# EAGLE design board (EAGLE 7.6.0)
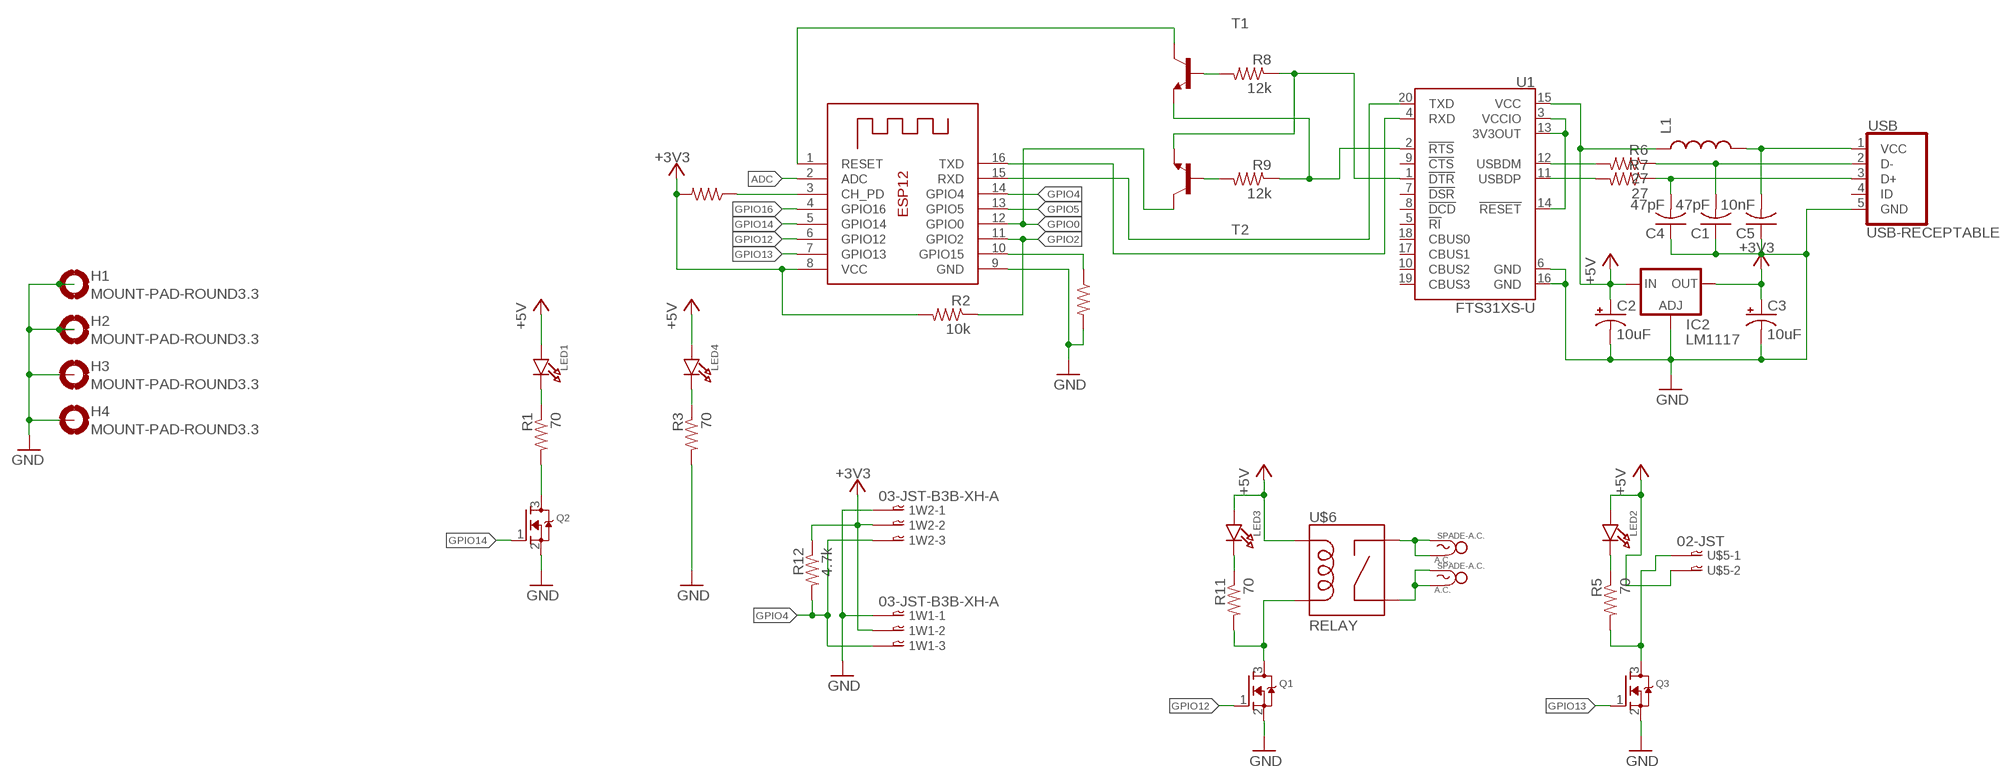
[diagram p0: schematic, sheet 1]

## Parts
1W1  03-JST-B3B-XH-A  [B3B-XH]
1W2  03-JST-B3B-XH-A  [B3B-XH]
C1  47pF  C-USC0603  [C0603]
C2  10uF  CPOL-US153CLV-0405  [153CLV-0405]
C3  10uF  CPOL-US153CLV-0405  [153CLV-0405]
C4  47pF  C-USC0603  [C0603]
C5  10nF  C-USC0603  [C0603]
H1  MOUNT-PAD-ROUND3.3  [3,3-PAD]
H2  MOUNT-PAD-ROUND3.3  [3,3-PAD]
H3  MOUNT-PAD-ROUND3.3  [3,3-PAD]
H4  MOUNT-PAD-ROUND3.3  [3,3-PAD]
IC2  LM1117  LD117ADT-TR  [DPACK]
L1  INDUCTOR0805  [0805]
LED1  LED0805  [CHIPLED_0805]
LED2  LED0805  [CHIPLED_0805]
LED3  LED0805  [CHIPLED_0805]
LED4  LED0805  [CHIPLED_0805]
Q1  MOSFET-NREFLOW  [SOT23]
Q2  MOSFET-NREFLOW  [SOT23]
Q3  MOSFET-NREFLOW  [SOT23]
R1  70  R-US_R0603  [R0603]
R2  10k  R-US_R0603  [R0603]
R3  70  R-US_R0603  [R0603]
R4  10k  R-US_R0603  [R0603]
R5  70  R-US_R0603  [R0603]
R6  27  R-US_R0603  [R0603]
R7  27  R-US_R0603  [R0603]
R8  12k  R-US_R0603  [R0603]
R9  12k  R-US_R0603  [R0603]
R10  10k  R-US_R0603  [R0603]
R11  70  R-US_R0603  [R0603]
R12  4.7k  R-US_R0603  [R0603]
T1  MMBT918LT1-NPN-SOT23-BEC  [SOT23-BEC]
T2  MMBT918LT1-NPN-SOT23-BEC  [SOT23-BEC]
U1  FTS31XS-U  FT231XS  [SSOP20_L]
U$1  SPADE-A.C.  [SPADE-A.C.]
U$2  SPADE-A.C.  [SPADE-A.C.]
U$5  02-JST  [B2B-XH]
U$6  RELAY  [RELAY-G5NB]
USB  USB-RECEPTABLE  [FCI-10103594-0001LF]
X1  ESP-12  [ESP-12]

## Nets
+3V3: 1W1.P$2 1W2.P$2 C3.+ IC2.4(OUT) R2.2 R4.2 R12.1 X1.8(VCC)
+5V: C2.+ IC2.3(IN) L1.1 LED1.A LED2.A LED3.A LED4.A U1.15(VCC) U$5.P$2 U$6.1(COIL1)
ADC: X1.2(ADC)
GND: 1W1.P$1 1W2.P$1 C1.1 C2.- C3.- C4.1 C5.1 H1.B3,3(MOUNT) H2.B3,3(MOUNT) H3.B3,3(MOUNT) H4.B3,3(MOUNT) IC2.1(ADJ) Q1.2(S) Q2.2(S) Q3.2(S) R3.2 R10.2 U1.6(GND) U1.16(GND) USB.5(GND) X1.9(GND)
GND1: Q3.3(D) R5.2 U$5.P$1
GND2: Q1.3(D) R11.2 U$6.4(COIL2)
GND3: Q2.3(D) R1.2
GPIO0: T2.C X1.12(GPIO0)
GPIO2: R2.1 X1.11(GPIO2)
GPIO4: 1W1.P$3 1W2.P$3 R12.2 X1.14(GPIO4)
GPIO5: X1.13(GPIO5)
GPIO12: Q1.1(G) X1.6(GPIO12)
GPIO13: Q3.1(G) X1.7(GPIO13)
GPIO14: Q2.1(G) X1.5(GPIO14)
GPIO15: R10.1 X1.10(GPIO15)
GPIO16: X1.4(GPIO16)
N$1: R4.1 X1.3(CH_PD)
N$2: C4.2 R7.1 USB.3(D+)
N$3: R7.2 U1.11(USBDP)
N$4: LED4.C R3.1
N$5 [ac]: U$2.P$1 U$2.P$2 U$6.3(NO)
N$6 [ac]: U$1.P$1 U$1.P$2 U$6.2(MAIN)
N$7: C5.2 L1.2 USB.1(VCC)
N$8: LED3.C R11.1
N$9: R6.2 U1.12(USBDM)
N$10: LED2.C R5.1
N$12: LED1.C R1.1
N$13: C1.2 R6.1 USB.2(D-)
N$14: R8.1 T2.E U1.1(!DTR)
N$15: R9.1 T1.E U1.2(!RTS)
N$16: R8.2 T1.B
N$17: R9.2 T2.B
N$19: U1.3(VCCIO) U1.13(3V3OUT) U1.14(!RESET)
RST: T1.C X1.1(RESET)
RXI: U1.20(TXD) X1.15(RXD)
TXO: U1.4(RXD) X1.16(TXD)
Unconnected: U1.5(!RI) U1.7(!DSR) U1.8(!DCD) U1.9(!CTS) U1.10(CBUS2) U1.17(CBUS1) U1.18(CBUS0) U1.19(CBUS3) USB.4(ID)

## Library data of the parts
1W1 1W2 = con-jst-xh:03-JST: JST CONNECTOR
C1 C4 C5 = rcl:C-US: CAPACITOR, American symbol
C2 C3 = rcl:CPOL-US: POLARIZED CAPACITOR, American symbol
H1-H4 = holes:MOUNT-PAD-ROUND: MOUNTING PAD, round
IC2 = v-reg:LD117A?*: Low drop fixed and adjustable positive voltage regulators 1 A Source: http://www.st.com/stonline/products/literature/ds/7194/ld1117axx.pdf
L1 = SparkFun-Passives:INDUCTOR: Inductors Basic Inductor/Choke - 0603 and 1206. Footprints are not proven and vary greatly between part numbers. INDUCTOR POWER 3.3UH 4.0A SMD 0.197" L x 0.197" W x 0.177" H (5.00mm x 5.00mm x 4.50mm)
LED1-LED4 = microbuilder:LED: LED 0603 - 0603 Surface Mount Package 2mA: Green LED - Low Power (3.9mcd, 2ma, 1.7Vf) - Digikey: 475-2709-2-ND Orange LED - Low Power (9.8mcd, 2ma, 1.8Vf) - Digikey: 475-1194-2-ND Red LED - Low Power (5mcd, 2ma, 1.8Vf) - Digikey: 475-1195-2-ND Yellow LED - Low Power (7mcd, 2ma, 1.8Vf) - Digikey: 475-1196-2-ND 5mA: Blue LED - Low Power (17mcd, 5ma, 2.9Vf) - Digikey: LNJ937W8CRACT-ND 0805 - 0805 Surface Mount Package 2mA: Red LED (8.8mcd, 2mA, 1.8Vf, Clear) - Low Power [Digikey: 475-2510-1-ND] Green LED (5mcd, 2mA, 1.8Vf, Clear) - Low Power [Digikey: 475-2730-1-ND] Yellow LED (11.3mcd, 2mA, 1.8Vf, Clear) - Low Power [Digikey: 475-2555-1-ND] 20mA: Red LED (104mcd, 20mA, Diffused) - LS R976 [Digikey: 475-1278-6-ND] Red LED (12mcd, 20mA, 2.0Vf, Clear) - APT2012EC [Digikey: 754-1128-1-ND] Green LED (15mcd, 20mA, 2.2Vf, Clear) - APT2012GC [Digikey: 754-1131-1-ND] Orange LED (160mcd, 20mA, 2.1Vf, Clear) - APT2012SECK [Digikey: 754-1130-1-ND] 1206 - 1206 Surface Mount Package Green LED (26mcd, 20mA, Diffused) - LG N971 [Digikey: 475-1407-6-ND] Red LED (15mcd, 20mA, Diffused) - LH N974 [Digikey: 475-1416-6-ND] Cree - Cree High-Power Surface Mount LEDs XPEBWT-L1-0000-00D50 - White 111lm 350mA 2.9Vf 6200K 110° XTEAWT-00-0000-00000LEE3 - White 114lm 350mA 2.85Vf 5000K 115° Everlight - Everlight 45-21 Series Surface Mount LEDs 45-21/QK2C-B2832AC2CB2/2T - Warm White 2000mcd 20mA 3.25Vf 3050K 120° 45-21/LK2C-B38452C4CB2/2T - Nuetral White 2000mcd 20mA 3.25Vf 4150K 120° 45-21/LK2C-B50634C6CB2/2T - Cold White 2200mcd 20mA 3.25Vf 5650K 120° PLCC2 Reverse Mount LS T77K-J1L2-1-0-2-R18-Z - Red 11.25mcd 2mA 1.8Vf 630nm 120° LO T77K-L1M2-24-Z - Orange 19.6mcd 2mA 1.8Vf 606nm 120° LY T77K-K2M1-26-Z - Yellow 15.7mcd 2mA 1.8Vf 587nm 120°
Q1-Q3 = adafruit:MOSFET-N: N-Channel Mosfet 2N7002E - 60V 260mA SOT23 [Digikey: 2N7002ET1GOSTR-ND] - REEL BSH103 - 30V 850mA SOT23 [Digikey: 568-5013-1-ND]
R1-R12 = resistor:R-US_: RESISTOR, American symbol
T1 T2 = transistor:*-NPN-: NPN Transistror BF959 corrected 2008.03.06
U1 = SparkFun-DigitalIC:FT231X: FTDI FT231X Full Speed USB to Full-handshake UART This USB2.0 Full Speed IC offers a compact bridge to full handshake UART interfaces. The device is a UART, capable of operating up to 3MBaud, with low power consumption (8mA). The FT231X includes the complete FT-X series feature set and enables USB to be added into a system design quickly and easily over a UART interface.; PROD_ID: IC-11524
U$1 U$2 = Spade-terminals:SPADE-A.C.: 0.25" Spade
U$5 = con-jst-xh:02-JST: JST CONNECTOR
U$6 = kleinpa:RELAY: SPDT relay (COM-00101)
USB = daspilker:USB-RECEPTABLE: USB Receptable
X1 = adafruit:ESP-12

## Net classes
0 default: drill 0.305 mm
1 ac: width 1.93 mm, clearance 5 mm
2 5v: width 0.61 mm

## Board
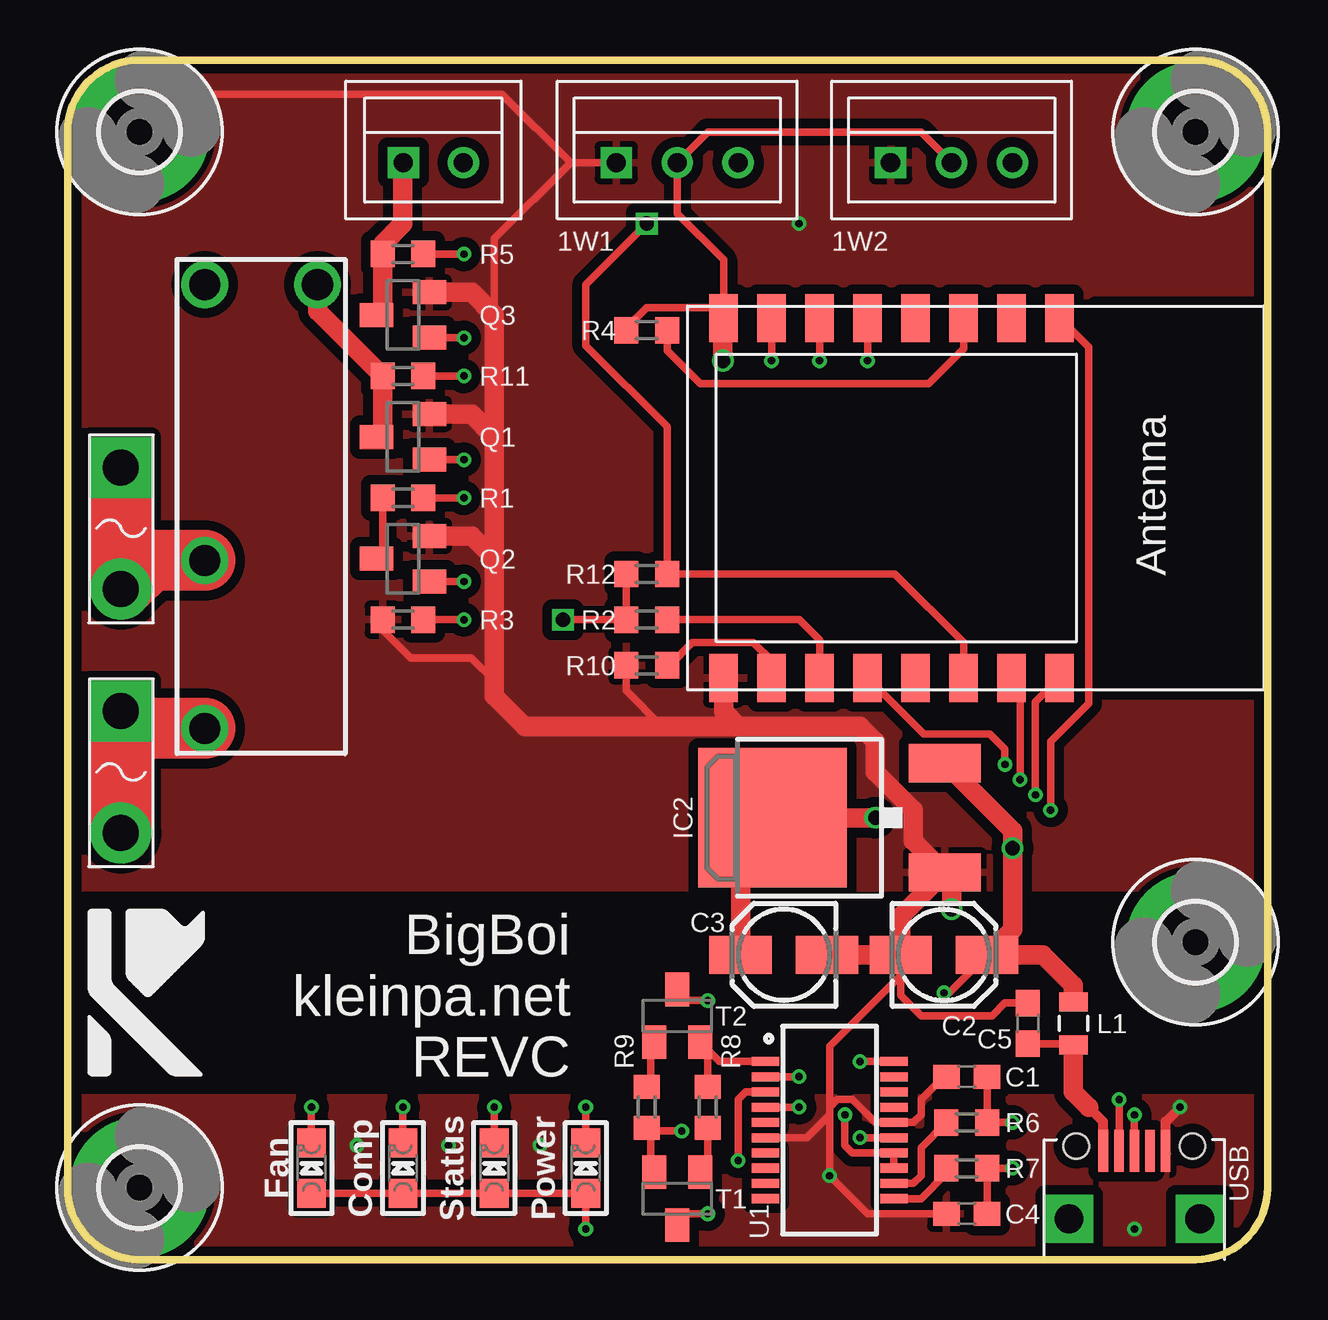
[diagram p1: board, top side]
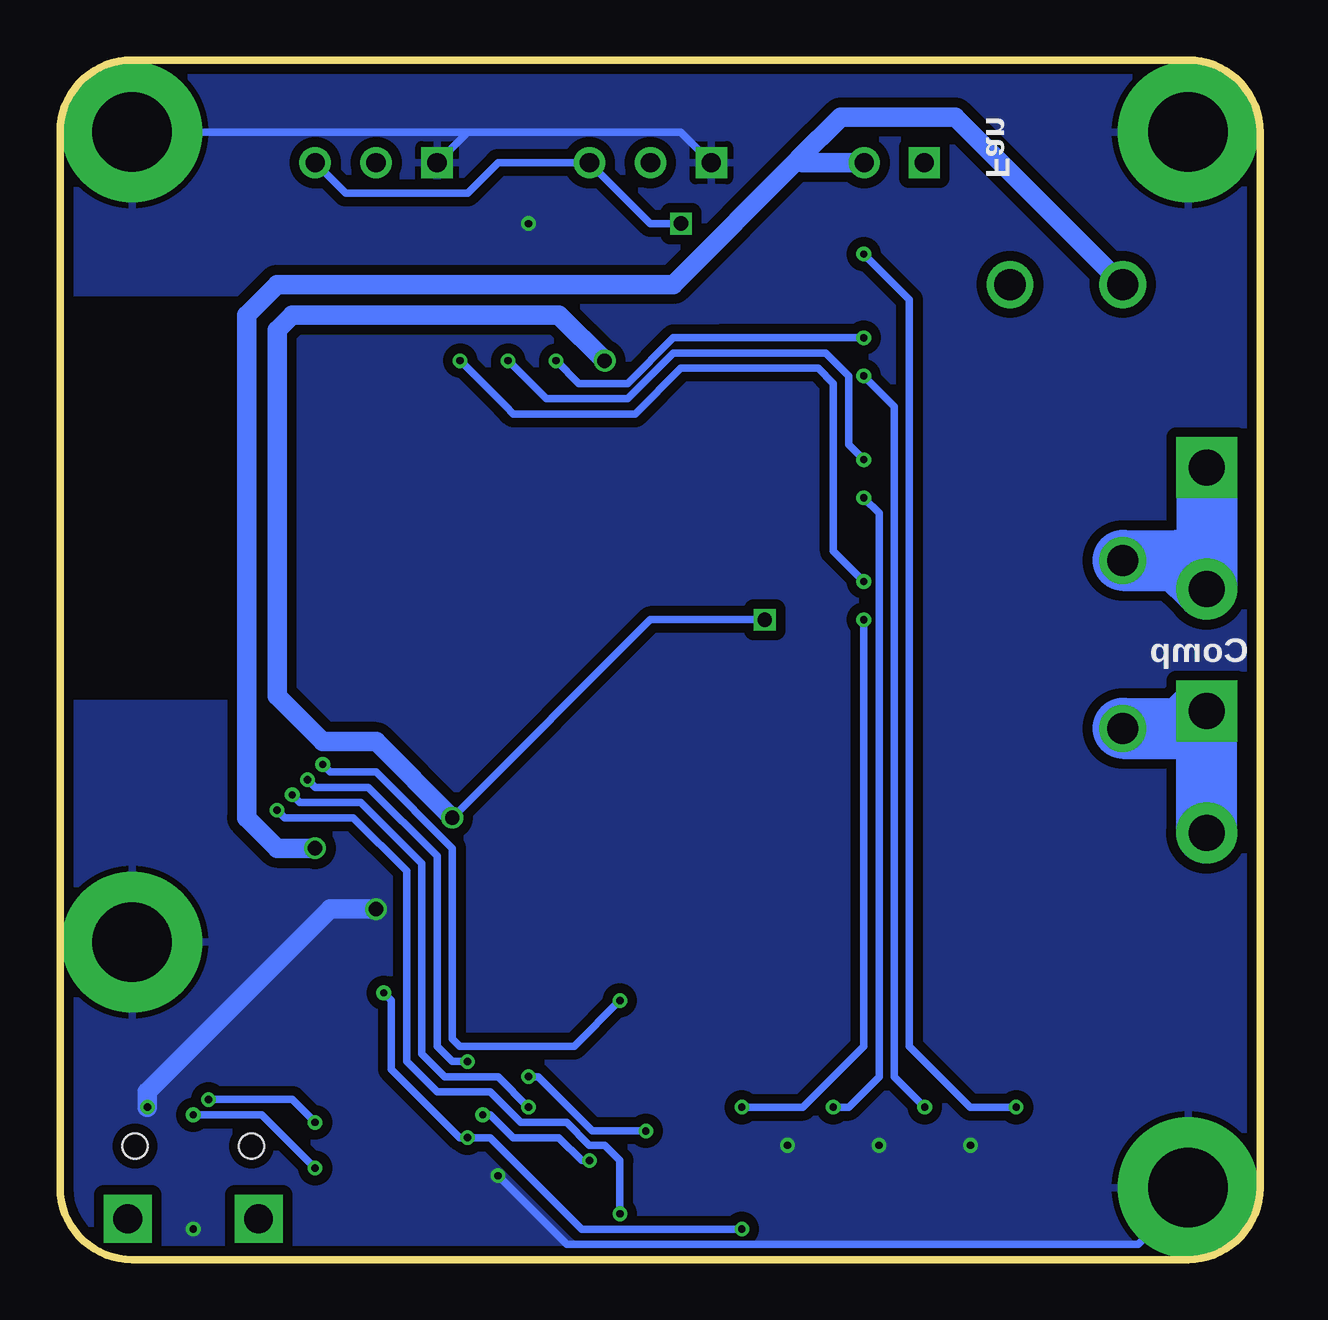
[diagram p2: board, bottom side, seen from below]

Size 50 x 50 mm. Coordinates in mm from the lower left corner, seen from the top.
Outline: 0,47 0,3 arc90 3,0 47,0 arc90 50,3 50,47 arc90 47,50 3,50 arc90 0,47
Copper layers (1*16): Top 0.035mm / dielectric 1.5mm / Bottom 0.035mm
Design rules "dirt_cheap_dirty_boards.v1": minimum track width 5mil, minimum drill 12mil, track to track 5mil, track to pad 5mil, pad to pad 5mil, via to via 5mil, smd to smd 0mil, copper to edge 10mil, drill to drill 10mil, minimum pad ring 10mil, minimum via ring 6mil, stop-mask expansion 2mil, vias tented up to drill 25mil, thermal gap 10mil
tRestrict: area -2.5,7.3 to 54.6,14.9

### Footprints (pad centres in the part's own frame; a part is rotated, then mirrored left to right if it is on the bottom)
B3B-XH = drill 0.8 square: P$1 -2.54,0 | drill 0.8: P$2 0,0; P$3 2.54,0
C0603 = smd 1.1 x 1: 1 -0.85,0; 2 0.85,0
153CLV-0405 = smd 2.6 x 1.6: + 1.8,0; - -1.8,0
3,3-PAD = drill 3.3 pad 5.842: B3,3 0,0
DPACK = smd 1.6 x 3: 1 -2.28,-4.8; 3 2.28,-4.8 | smd 5.8 x 6.2: 4 0,2.38
0805 = smd 0.8 x 1.2: 1 -0.9,0; 2 0.9,0
CHIPLED_0805 = smd 1.2 x 1.2: A 0,-1.05; C 0,1.05
SOT23 = smd 1 x 1.4: 1 -0.95,-1.1; 2 0.95,-1.1; 3 0,1.1
R0603 = smd 1 x 1.1: 1 -0.85,0; 2 0.85,0
SOT23-BEC = smd 1 x 1.4: B -0.95,-1.1; C 0,1.1; E 0.95,-1.1
SSOP20_L = smd 0.381 x 1.143: 1 -2.857,-2.68; 2 -2.223,-2.68; 3 -1.587,-2.68; 4 -0.953,-2.68; 5 -0.318,-2.68; 6 0.318,-2.68; 7 0.953,-2.68; 8 1.587,-2.68; 9 2.223,-2.68; 10 2.857,-2.68; 11 2.857,2.68; 12 2.223,2.68; 13 1.587,2.68; 14 0.953,2.68; 15 0.318,2.68; 16 -0.318,2.68; 17 -0.953,2.68; 18 -1.587,2.68; 19 -2.223,2.68; 20 -2.857,2.68
SPADE-A.C. = drill 1.5 pad 2.54: P$1 0,-2.54 | drill 1.5 pad 2.54 square: P$2 0,2.54
B2B-XH = drill 0.8 square: P$1 -1.25,0 | drill 0.8: P$2 1.25,0
RELAY-G5NB = drill 1.3: 1 0,0; 2 11.5,0; 3 18.5,0; 4 0,4.7
FCI-10103594-0001LF = smd 0.4 x 1.75: 1 -1.3,4.525; 2 -0.65,4.525; 3 0,4.525; 4 0.65,4.525; 5 1.3,4.525 | drill 1.2 pad 2 square: P$3 -2.725,1.7; P$4 2.725,1.7 | hole 1.05: -2.425,4.73; 2.425,4.73
ESP-12 = smd 2 x 1.2: 1 -7.5,4.5; 2 -7.5,2.5; 3 -7.5,0.5; 4 -7.5,-1.5; 5 -7.5,-3.5; 6 -7.5,-5.5; 7 -7.5,-7.5; 8 -7.5,-9.5; 9 7.5,-9.5; 10 7.5,-7.5; 11 7.5,-5.5; 12 7.5,-3.5; 13 7.5,-1.5; 14 7.5,0.5; 15 7.5,2.5; 16 7.5,4.5

### Placement (x,y rotation side)
1W1  25.4,45.72 0 top
1W2  36.83,45.72 0 top
C1  37.47,7.62 0 top
C2  36.51,12.7 0 top
C3  29.84,12.7 180 top
C4  37.47,1.91 0 top
C5  40.01,9.84 270 top
H1  47,13.23 0 top
H2  3,3 0 top
H3  47,47 0 top
H4  3,47 0 top
IC2  31.75,18.41 90 top
L1  41.91,9.84 270 top
LED1  17.78,3.81 0 top
LED2  10.16,3.81 0 top
LED3  13.97,3.81 0 top
LED4  21.59,3.81 0 top
Q1  13.97,34.29 90 top
Q2  13.97,29.21 90 top
Q3  13.97,39.37 90 top
R1  13.97,31.75 180 top
R2  24.13,26.67 180 top
R3  13.97,26.67 180 top
R4  24.13,38.73 180 top
R5  13.97,41.91 180 top
R6  37.47,5.71 180 top
R7  37.47,3.81 180 top
R8  26.67,6.35 270 top
R9  24.13,6.35 90 top
R10  24.13,24.77 180 top
R11  13.97,36.83 180 top
R12  24.13,28.57 0 top
T1  25.4,2.54 180 top
T2  25.4,10.16 0 top
U1  31.75,5.4 270 top
U$1  2.22,30.48 0 top
U$2  2.22,20.32 0 top
U$5  15.24,45.72 0 top
U$6  5.71,40.64 270 top
USB  44.45,0 0 top
X1  36.83,31.75 270 top

### Tracks (layer width: path | path; a pad name or v marks a point on that pad's centre or on a via)
+3V3  (via drill 0.6)
  Top 0.305: 1W2.P$2 35.56,46.99 26.67,46.99 1W1.P$2 25.4,43.6 27.33,41.67 X1.8 26.89,39.69 24.13,39.69 23.28,38.84 R4.2 | R2.2 23.18,26.67 | 27.62,18.41 IC2.4 | R2.2 v20.64,26.67 | R12.1 R2.2
  Top 0.406: 27.09,39.49 X1.8
  Top 0.813: v33.66,18.41 IC2.4 28.05,17.09 C3.+ | v27.3,37.47 27.3,39.23 X1.8
  Bottom 0.305: v33.66,18.41 25.4,26.67 v20.64,26.67
  Bottom 0.813: v27.3,37.47 29.21,39.37 40.32,39.37 40.96,38.73 40.96,23.5 39.05,21.59 36.83,21.59 v33.66,18.41
+5V  (via drill 0.3, 0.6)
  Top 0.305: U1.15 v33.02,5.08 | v21.59,1.27 LED4.A LED1.A LED3.A LED2.A | C2.+ 36.73,11.11 v36.51,11.11
  Top 0.813: C2.+ 39.37,13.76 v39.37,17.14 39.37,17.88 IC2.3 | 38.58,12.96 C2.+ | 38.31,12.49 C2.+ | L1.1 41.91,11.43 40.64,12.7 C2.+
  Bottom 0.305: v21.59,1.27 28.26,1.27 32.07,5.08 v33.02,5.08 33.34,5.08 36.2,7.94 36.2,10.79 v36.51,11.11
  Bottom 0.813: U$6.1 12.7,47.62 17.46,47.62 19.21,45.88 | 19.21,45.88 24.45,40.64 40.96,40.64 42.23,39.37 42.23,18.41 40.96,17.14 v39.37,17.14 | U$5.P$2 19.05,45.72 19.21,45.88
GND  (via drill 0.3, 0.6)
  Top 0.305: U1.6 30.8,5.08 31.75,6.03 | C4.1 33.34,1.91 v31.75,3.49 31.75,6.03 | 23.28,24.66 R10.2 23.28,23.71 24.77,22.23 | H4.B3,3 4.58,48.58 18.1,48.58 20.95,45.72 | 20.95,45.72 1W1.P$1 | 20.95,45.72 17.78,42.55 17.78,39.37 | 17.78,24.13 16.83,25.08 14.29,25.08 13.12,26.25 R3.2 | C1.1 36.51,7.62 35.56,6.67 35.56,6.03 35.24,5.71 U1.16 33.66,5.71 32.7,6.67 32.07,6.67 31.75,6.35 | 31.75,6.35 31.75,6.03 | 34.71,12.28 34.71,11.85 31.75,8.89 31.75,6.35 | C5.1 39.05,10.69 38.52,10.16 35.56,10.16 34.71,11.01 C2.-
  Top 0.406: USB.5 45.75,5.75 v46.35,6.35
  Top 0.813: C3.- C2.- | C2.- 34.71,14.3 IC2.1 | C2.- 34.71,12.28 | IC2.1 35.24,17.44 35.24,18.73 33.66,20.32 33.66,21.59 33.02,22.23 27.94,22.23 | 27.94,22.23 27.33,22.84 X1.9 | 27.94,22.23 19.05,22.23 17.78,23.5 17.78,24.13 17.78,29.21 | Q3.2 16.83,40.32 17.78,39.37 17.78,34.29 | 17.78,34.29 17.78,29.21 | Q1.2 16.83,35.24 17.78,34.29 | Q2.2 16.83,30.16 17.78,29.21 | v36.83,14.61 36.83,16.14 IC2.1
  Bottom 0.305: 1W1.P$1 24.13,46.99 33.02,46.99 | 33.02,46.99 1W2.P$1 | H3.B3,3 33.02,46.99 | v31.75,3.49 28.89,0.64 5.08,0.64 3,2.71 H2.B3,3
  Bottom 0.813: v46.35,6.35 46.35,6.99 38.73,14.61 v36.83,14.61
  other vias: 12.06,4.76 15.88,4.76 19.68,4.76 30.48,43.18 44.45,1.27
  pour Top (isolate 0.406): -3.81,50.8 50.8,50.8 50.8,17.78 52.07,17.78 52.07,-1.27 -1.27,-1.27 -1.27,48.26 -3.81,48.26
  pour Bottom (isolate 0.406): -3.81,46.99 -1.27,46.99 -1.27,50.8 50.8,50.8 50.8,49.53 52.07,49.53 52.07,-1.27 -1.27,-1.27 -1.27,44.45 -3.81,44.45
GND1
  Top 0.813: Q3.3 13.12,39.62 R5.2 13.12,42.33 13.97,43.18 13.97,45.7 U$5.P$1
GND2
  Top 0.813: Q1.3 13.12,34.54 R11.2 10.41,39.53 U$6.4
GND3
  Top 0.305: 12.7,29.21 Q2.3 13.12,29.46 R1.2
GPIO0  (via drill 0.3)
  Top 0.305: T2.C 25.86,10.79 v26.67,10.79 | X1.12 35.67,21.91 38.42,21.91 39.05,21.27 v39.05,20.64
  Bottom 0.305: v26.67,10.79 28.57,8.89 33.34,8.89 33.66,9.21 33.66,17.14 36.83,20.32 38.73,20.32 v39.05,20.64
GPIO2
  Top 0.305: R2.1 30.48,26.67 31.33,25.82 X1.11
GPIO4  (via drill 0.6)
  Top 0.305: X1.14 37.33,25.72 34.47,28.57 R12.2 24.98,34.71 21.59,38.1 21.59,40.64 v24.13,43.18
  Bottom 0.305: v24.13,43.18 25.4,43.18 1W1.P$3 31.75,45.72 33.02,44.45 38.1,44.45 1W2.P$3
GPIO12  (via drill 0.3)
  Top 0.305: Q1.1 v16.51,33.34 | X1.6 v31.33,37.47
  Bottom 0.305: v31.33,37.47 29.74,35.88 26.35,35.88 24.45,37.78 18.1,37.78 17.14,36.83 17.14,33.98 v16.51,33.34
GPIO13  (via drill 0.3)
  Top 0.305: Q3.1 v16.51,38.42 | X1.7 v29.33,37.47
  Bottom 0.305: 22.54,38.42 v16.51,38.42 24.45,38.42 26.35,36.51 28.38,36.51 v29.33,37.47
GPIO14  (via drill 0.3)
  Top 0.305: X1.5 v33.33,37.47 | Q2.1 v16.51,28.26
  Bottom 0.305: v33.33,37.47 31.43,35.56 31.11,35.24 26.04,35.24 24.13,37.15 18.41,37.15 17.78,36.51 17.78,29.53 v16.51,28.26
GPIO15
  Top 0.305: R10.1 25.08,24.77 26.04,25.72 28.57,25.72 29.33,24.96 X1.10
N$1
  Top 0.305: R4.1 24.98,37.88 26.35,36.51 35.88,36.51 37.33,37.97 X1.3
N$2  (via drill 0.3)
  Top 0.305: C4.2 R7.1 v39.37,3.81 | USB.3 v44.45,6.03
  Bottom 0.305: v44.45,6.03 41.59,6.03 v39.37,3.81
N$3
  Top 0.305: R7.2 36.62,3.6 35.56,2.54 U1.11
N$4  (via drill 0.3)
  Top 0.305: R3.1 v16.51,26.67 | v21.59,6.35 LED4.C
  Bottom 0.305: v16.51,26.67 16.51,8.89 19.05,6.35 v21.59,6.35
N$5
  Top 2.54: U$6.3 2.94,22.14 U$2.P$2 U$2.P$1
  Bottom 2.54: U$2.P$1 U$2.P$2 | U$6.3 3.26,22.14 2.54,22.86
N$6
  Top 2.54: U$6.2 3.42,29.14 U$1.P$1 U$1.P$2
  Bottom 2.54: U$1.P$2 U$1.P$1 3.42,29.14 U$6.2
N$7
  Top 0.305: L1.2 41.86,8.99 C5.2
  Top 0.406: USB.1 43.15,5.75 42.55,6.35
  Top 0.813: 42.55,6.35 41.91,6.99 L1.2
N$8  (via drill 0.3)
  Top 0.305: R11.1 v16.51,36.83 | v13.97,6.35 LED3.C
  Bottom 0.305: v16.51,36.83 15.24,35.56 15.24,7.62 v13.97,6.35
N$9
  Top 0.305: U1.12 35.24,3.17 35.56,3.49 35.56,4.66 R6.2
N$10  (via drill 0.3)
  Top 0.305: R5.1 v16.51,41.91 | v10.16,6.35 LED2.C
  Bottom 0.305: v16.51,41.91 14.61,40.01 14.61,8.89 12.06,6.35 v10.16,6.35
N$12  (via drill 0.3)
  Top 0.305: R1.1 v16.51,31.75 | v17.78,6.35 LED1.C
  Bottom 0.305: v16.51,31.75 15.88,31.11 15.88,7.62 17.14,6.35 v17.78,6.35
N$13  (via drill 0.3)
  Top 0.305: C1.2 R6.1 v39.37,5.71 | USB.2 43.81,4.54 v43.81,6.67
  Bottom 0.305: v43.81,6.67 40.32,6.67 v39.37,5.71
N$14
  Top 0.305: R8.1 26.67,8.81 26.45,9.03 T2.E | 26.45,9.25 T2.E | U1.1 27.16,8.26 T2.E
N$15  (via drill 0.3)
  Top 0.305: 24.3,5.36 24.3,3.85 T1.E | 24.3,5.36 v25.59,5.36 | 24.3,5.36 R9.1 | U1.2 v30.48,7.62
  Bottom 0.305: v25.59,5.36 27.81,5.36 30.07,7.62 v30.48,7.62
N$16
  Top 0.305: R8.2 26.67,4.06 26.45,3.85 T1.B
N$17
  Top 0.305: R9.2 24.3,7.3 24.3,9.03 T2.B
N$19  (via drill 0.3)
  Top 0.305: U1.3 28.26,6.99 27.94,6.67 v27.94,4.13 | v32.38,6.03 32.38,4.76 32.7,4.45 U1.14 U1.13
  Bottom 0.305: v27.94,4.13 28.26,4.13 29.21,5.08 31.11,5.08 32.07,6.03 v32.38,6.03
RST  (via drill 0.3)
  Top 0.305: T1.C 25.86,1.91 v26.67,1.91 | X1.1 42.55,38.03 42.55,23.18 40.96,21.59 v40.96,18.73
  Bottom 0.305: v26.67,1.91 26.67,4.13 27.3,4.76 27.94,4.76 28.89,5.71 30.8,5.71 32.07,6.99 34.29,6.99 35.56,8.26 35.56,16.19 37.78,18.41 40.64,18.41 v40.96,18.73
RXI  (via drill 0.3)
  Top 0.305: U1.20 v33.02,8.26 | v39.69,20 39.69,23.89 X1.15
  Bottom 0.305: v33.02,8.26 33.66,8.26 34.29,8.89 34.29,16.83 37.15,19.68 39.37,19.68 v39.69,20
TXO  (via drill 0.3)
  Top 0.305: U1.4 v30.48,6.35 | v40.32,19.37 40.32,23.24 X1.16
  Bottom 0.305: v30.48,6.35 31.75,7.62 33.97,7.62 34.92,8.57 34.92,16.51 37.47,19.05 40.01,19.05 v40.32,19.37

### Text on the board
tNames: BigBoi / kleinpa.net / REVC | Fan | Comp | Status | Power
bNames: Fan | Comp